# EAGLE design DriverModuleQT (EAGLE 9.6.2)
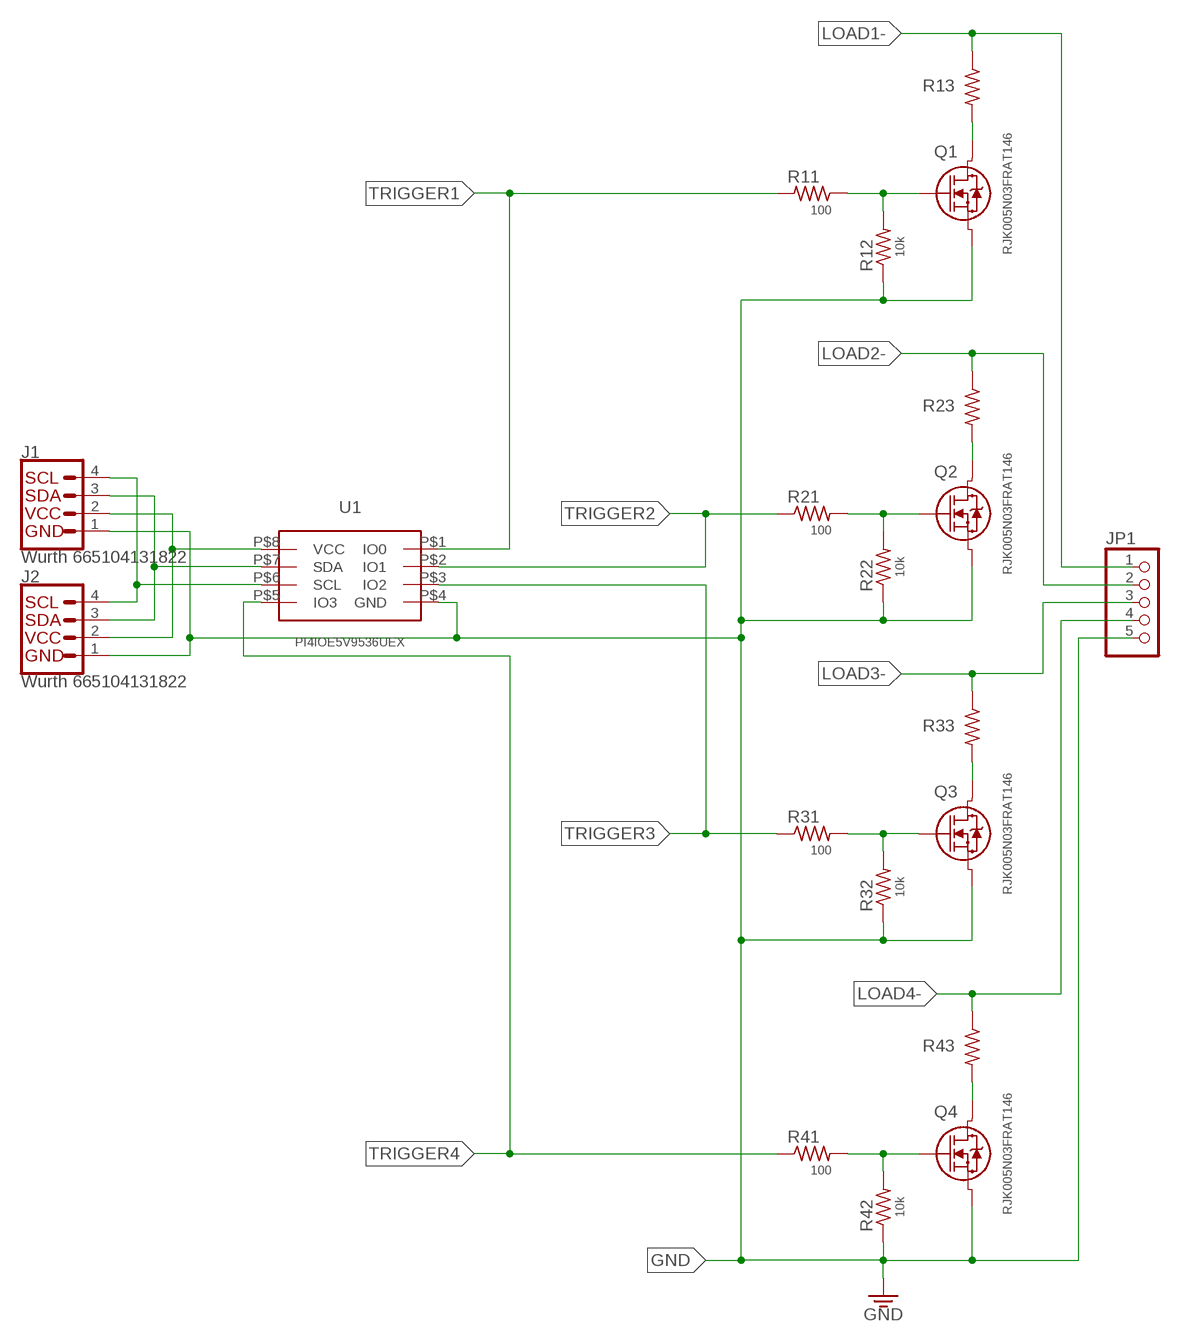
[diagram p0: schematic, sheet 1]

## Parts
J1  Wurth 665104131822  QWIIC_CONNECTORJS-1MM  [1X04_1MM_RA]
J2  Wurth 665104131822  QWIIC_CONNECTORJS-1MM  [1X04_1MM_RA]
JP1  HEADER-1X576MIL  [1X05_ROUND_76]
Q1  RJK005N03FRAT146  RJK005N03FRAT146TRANS_RHK003N_ROM-M  [TRANS_RHK003N_ROM-M]
Q2  RJK005N03FRAT146  RJK005N03FRAT146TRANS_RHK003N_ROM-M  [TRANS_RHK003N_ROM-M]
Q3  RJK005N03FRAT146  RJK005N03FRAT146TRANS_RHK003N_ROM-M  [TRANS_RHK003N_ROM-M]
Q4  RJK005N03FRAT146  RJK005N03FRAT146TRANS_RHK003N_ROM-M  [TRANS_RHK003N_ROM-M]
R11  100  R-US_R0603  [R0603]
R12  10k  R-US_R0603  [R0603]
R13  R-US_R1206  [R1206]
R21  100  R-US_R0603  [R0603]
R22  10k  R-US_R0603  [R0603]
R23  R-US_R1206  [R1206]
R31  100  R-US_R0603  [R0603]
R32  10k  R-US_R0603  [R0603]
R33  R-US_R1206  [R1206]
R41  100  R-US_R0603  [R0603]
R42  10k  R-US_R0603  [R0603]
R43  R-US_R1206  [R1206]
U1  PI4IOE5V9536UEX  PI4IOE5V9536-UEX  [MSOP-8]

## Nets
GATE1 [8mil]: Q1.2 R11.1 R12.2
GATE2 [8mil]: Q2.2 R21.2 R22.2
GATE3 [8mil]: Q3.2 R31.2 R32.2
GATE4 [8mil]: Q4.2 R41.2 R42.2
GND [8mil]: J1.1(GND) J2.1(GND) JP1.5 Q1.3 Q2.3 Q3.3 Q4.3 R12.1 R22.1 R32.1 R42.1 U1.P$4(GND)
LD- [8mil]: Q4.1 R43.2
LD-1 [8mil]: Q3.1 R33.2
LD-2 [8mil]: Q2.1 R23.2
LD-3 [8mil]: Q1.1 R13.2
LOAD1- [8mil]: JP1.1 R13.1
LOAD2- [8mil]: JP1.2 R23.1
LOAD3- [8mil]: JP1.3 R33.1
LOAD4- [8mil]: JP1.4 R43.1
N$1: J1.4(SCL) J2.4(SCL) U1.P$6(SCL)
N$2: J1.3(SDA) J2.3(SDA) U1.P$7(SDA)
N$3: J1.2(VCC) J2.2(VCC) U1.P$8(VCC)
TRIGGER1 [8mil]: R11.2 U1.P$1(IO0)
TRIGGER2 [8mil]: R21.1 U1.P$2(IO1)
TRIGGER3 [8mil]: R31.1 U1.P$3(IO2)
TRIGGER4 [8mil]: R41.1 U1.P$5(IO3)

## Library data of the parts
J1 J2 = SparkFun-Connectors:QWIIC_CONNECTOR: SparkFun I2C Standard Qwiic Connector An SMD 1mm pitch JST connector makes it easy and quick (get it? Qwiic?) to connect I2C devices to each other. The Qwiic system <http://www.sparkfun.com/qwiic> enables fast and solderless connection between popular platforms and various sensors and actuators. We carry 200mm <https://www.sparkfun.com/products/14204>, 100mm <https://www.sparkfun.com/products/14205>, 50mm <https://www.sparkfun.com/products/14206>, and breadboard friendly <https://www.sparkfun.com/products/14207> Qwiic cables. We also offer 10 pcs strips <https://www.sparkfun.com/products/14323> the SMD connectors.
JP1 = microbuilder:HEADER-1X5: PIN HEADER
Q1-Q4 = home:RJK005N03FRAT146; COPYRIGHT: Copyright (C) 2022 Ultra Librarian. All rights reserved.; DIGI-KEY_PART_NUMBER_1: RJK005N03FRAT146CT-ND; DIGI-KEY_PART_NUMBER_2: RJK005N03FRAT146DKR-ND; DIGI-KEY_PART_NUMBER_3: RJK005N03FRAT146TR-ND; MANUFACTURER_PART_NUMBER: RJK005N03FRAT146; MFR_NAME: ROHM Semiconductor
R11-R13 R21-R23 R31-R33 R41-R43 = adafruit:R-US_: RESISTOR, American symbol
U1 = home:PI4IOE5V9536

## Net classes
1 8mil: width 0.203 mm

## Board
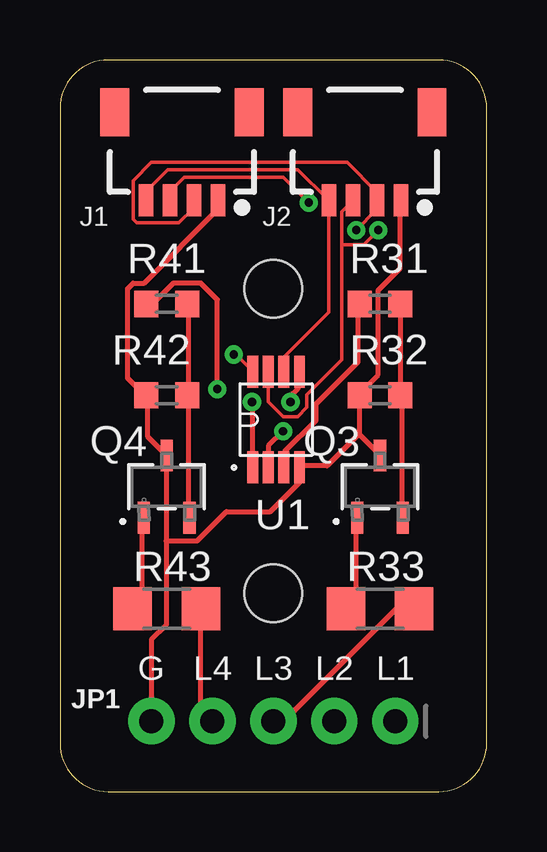
[diagram p1: board, top side]
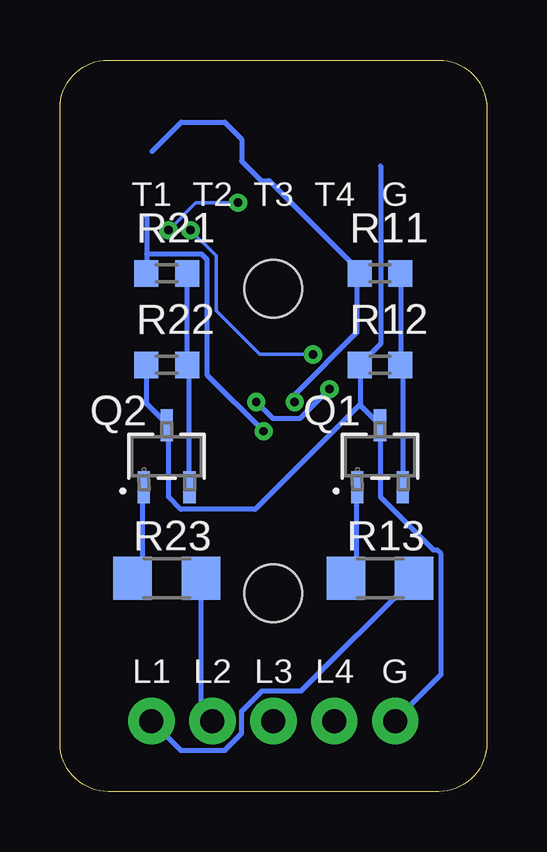
[diagram p2: board, bottom side, seen from below]

Size 17.78 x 30.48 mm. Coordinates in mm from the lower left corner, seen from the top.
Outline: 15.78,30.48 2,30.48 arc90 0,28.48 0,2 arc90 2,0 15.78,0 arc90 17.78,2 17.78,28.48 arc90 15.78,30.48
Copper layers (1*16): Top 0.035mm / dielectric 1.5mm / Bottom 0.035mm
Design rules "default": minimum track width 6mil, minimum drill 0.35mm, track to track 6mil, track to pad 6mil, pad to pad 6mil, via to via 6mil, smd to smd 6mil, copper to edge 40mil, drill to drill 6mil, minimum pad ring 10mil, minimum via ring 8mil, stop-mask expansion 4mil, vias tented up to drill 0mil, thermal gap 10mil
Holes 2.4 mm at 8.89,20.95 8.89,8.26

### Footprints (pad centres in the part's own frame; a part is rotated, then mirrored left to right if it is on the bottom)
1X04_1MM_RA = smd 0.6 x 1.35: 1 -1.5,0; 2 -0.5,0; 3 0.5,0; 4 1.5,0 | smd 1.2 x 2: NC1 2.8,-3.675; NC2 -2.8,-3.675
1X05_ROUND_76 = drill 1 pad 1.93: 1 -5.08,0; 2 -2.54,0; 3 0,0; 4 2.54,0; 5 5.08,0
TRANS_RHK003N_ROM-M = smd 0.508 x 1.321: 1 -0.953,-1.295; 2 0.953,-1.295; 3 0,1.295
R0603 = smd 1 x 1.1: 1 -0.85,0; 2 0.85,0
R1206 = smd 1.6 x 1.803: 1 -1.422,0; 2 1.422,0
MSOP-8 = smd 1.35 x 0.45: P$1 -1.99,0.975; P$2 -1.99,0.325; P$3 -1.99,-0.325; P$4 -1.99,-0.975; P$5 1.99,-0.975; P$6 1.99,-0.325; P$7 1.99,0.325; P$8 1.99,0.975

### Placement (x,y rotation side)
J1  5.08,24.64 180 top
J2  12.7,24.64 180 top
JP1  8.89,2.94 180 top
Q1  4.45,13.97 0 bottom
Q2  13.34,13.97 0 bottom
Q3  13.34,12.7 0 top
Q4  4.45,12.7 0 top
R11  4.45,21.59 180 bottom
R12  4.45,17.78 0 bottom
R13  4.45,8.89 180 bottom
R21  13.34,21.59 0 bottom
R22  13.34,17.78 0 bottom
R23  13.34,8.89 180 bottom
R31  13.34,20.32 0 top
R32  13.34,16.51 0 top
R33  13.34,7.62 180 top
R41  4.45,20.32 0 top
R42  4.45,16.51 0 top
R43  4.45,7.62 180 top
U1  9,15.5 90 top

### Tracks (layer width: path | path; a pad name or v marks a point on that pad's centre or on a via)
GATE1
  Bottom 0.203: R11.1 3.58,21.57 3.58,17.83 R12.2 3.5,17.75 3.5,12.72 Q1.2
GATE2
  Bottom 0.203: R21.2 12.5,21.57 12.5,17.83 R22.2 12.42,17.75 12.42,12.72 Q2.2
GATE3
  Top 0.203: R31.2 14.17,20.27 14.17,16.54 R32.2 14.25,16.46 14.25,11.43 Q3.2
GATE4
  Top 0.203: R41.2 5.33,20.27 5.33,16.54 R42.2 5.33,16.46 5.33,11.43 Q4.2
GND
  Top 0.203: 12.5,14.86 12.5,16.46 R32.1 12.5,16.61 13.26,17.37 13.26,20.88 14.17,21.79 14.17,24.61 J2.1 | 12.5,14.86 13.34,14.02 Q3.3 | 12.5,14.86 12.42,14.86 11.12,13.56 9.98,13.56 U1.P$4 9.98,13.41 9.98,12.88 8.76,11.66 6.93,11.66 5.71,10.44 4.42,10.44 | J1.1 6.55,24.61 6.55,24.23 3.5,21.18 3.05,21.18 2.82,20.95 2.82,17.22 3.5,16.54 R42.1 3.66,16.46 3.66,14.78 Q4.3 4.42,13.95 4.42,10.44 | JP1.5 3.81,6.33 4.42,6.93 4.42,10.44
  Bottom 0.203: R22.1 14.17,17.75 14.17,16.15 13.34,15.32 Q2.3 13.26,15.19 13.26,12.28 12.74,11.76 9.65,11.76 5.33,16.08 5.26,16.08 | 5.26,16.08 5.26,17.75 R12.1 4.42,18.66 4.42,26.06 | 5.26,16.08 Q1.3 4.42,15.24 4.42,12.27 2.21,10.06 2.06,10.06 1.91,9.91 1.91,4.88 3.81,2.97 JP1.5
LD-
  Top 0.203: Q4.1 3.43,11.35 3.43,8 3.05,7.62 R43.2
LD-1
  Top 0.203: Q3.1 12.34,11.35 12.34,8 11.96,7.62 R33.2
LD-2
  Bottom 0.203: Q2.1 14.33,12.65 14.33,9.3 14.71,8.91 R23.2
LD-3
  Bottom 0.203: Q1.1 5.41,12.65 5.41,9.3 5.79,8.91 R13.2
LOAD1-
  Bottom 0.203: JP1.1 12.75,1.72 10.93,1.72 10.21,2.43 10.21,3.34 9.36,4.19 7.72,4.19 R13.1
LOAD2-
  Bottom 0.203: R23.1 11.89,8.84 11.89,3.43 11.43,2.97 JP1.2
LOAD3-
  Top 0.203: R33.1 14.02,7.62 9.37,2.97 8.91,2.97 JP1.3
LOAD4-
  Top 0.203: R43.1 5.87,3.43 6.33,2.97 JP1.4 | R43.1
N$1
  Top 0.152: J1.4 3.58,24.69 3.58,24.99 4.5,25.91 9.91,25.91 11.12,24.69 J2.4 11.2,24.61 11.2,19.96 9.37,18.14 9.37,17.53 U1.P$6
N$2  (via drill 0.35)
  Top 0.152: 11.73,22.78 11.73,24.16 12.19,24.61 J2.3 | 11.73,22.78 11.73,17.98 10.29,16.54 10.29,16 9.91,15.62 9.3,15.62 8.69,16.23 8.69,17.45 U1.P$7 | v10.36,24.54 9.3,25.6 5.18,25.6 4.65,25.07 4.65,24.69 J1.3 | v13.26,23.39 12.65,22.78 11.73,22.78
  Bottom 0.152: v10.36,24.54 12.12,24.54 v13.26,23.39
N$3  (via drill 0.35)
  Top 0.152: v7.24,18.21 7.32,18.21 8,17.53 U1.P$8 | v12.34,23.39 13.18,24.23 13.18,24.61 J2.2 13.18,24.69 13.18,24.99 11.96,26.21 3.81,26.21 3.05,25.45 3.05,23.85 3.2,23.7 4.95,23.7 5.56,24.31 5.56,24.61 J1.2
  Bottom 0.152: v7.24,18.21 9.45,18.21 11.28,20.04 11.28,22.33 v12.34,23.39
TRIGGER1  (via drill 0.35)
  Top 0.203: v8,16.23 8,13.56 U1.P$1
  Bottom 0.203: 13.95,26.67 12.72,27.89 10.93,27.89 10.21,27.18 10.21,26.27 9.39,25.45 9.06,25.45 5.33,21.72 5.33,21.63 R11.2 5.41,21.57 5.41,19.13 8,16.54 v8,16.23
TRIGGER2  (via drill 0.35)
  Top 0.203: v9.3,15.01 8.69,14.4 8.69,13.56 U1.P$2
  Bottom 0.203: 14.17,23.93 14.17,22.4 | 14.17,22.4 14.17,21.6 R21.1 | v9.3,15.01 11.66,17.37 11.66,22.17 11.89,22.4 14.17,22.4
TRIGGER3
  Top 0.203: R31.1 12.42,20.27 12.42,17.91 10.67,16.15 10.67,15.47 9.37,14.17 9.37,13.56 U1.P$3
TRIGGER4  (via drill 0.35)
  Top 0.203: v6.55,16.76 6.55,20.5 5.87,21.18 4.72,21.18 3.89,20.34 3.66,20.34 R41.1 | v9.6,16.23 9.6,16.46 9.91,16.76 9.91,17.45 U1.P$5
  Bottom 0.203: v6.55,16.76 7.77,15.54 8.91,15.54 v9.6,16.23

### Text on the board
tPlace: G | L4 | L3 | L2 | L1
bPlace: G | T4 | T3 | T2 | T1 | G | L4 | L3 | L2 | L1